# Altium project REFLOW_Controller.PrjPcb (part 3 of 3)

## Sheet FetDrv.SchDoc
size A4; SheetNumber: 5; SheetTotal: 5
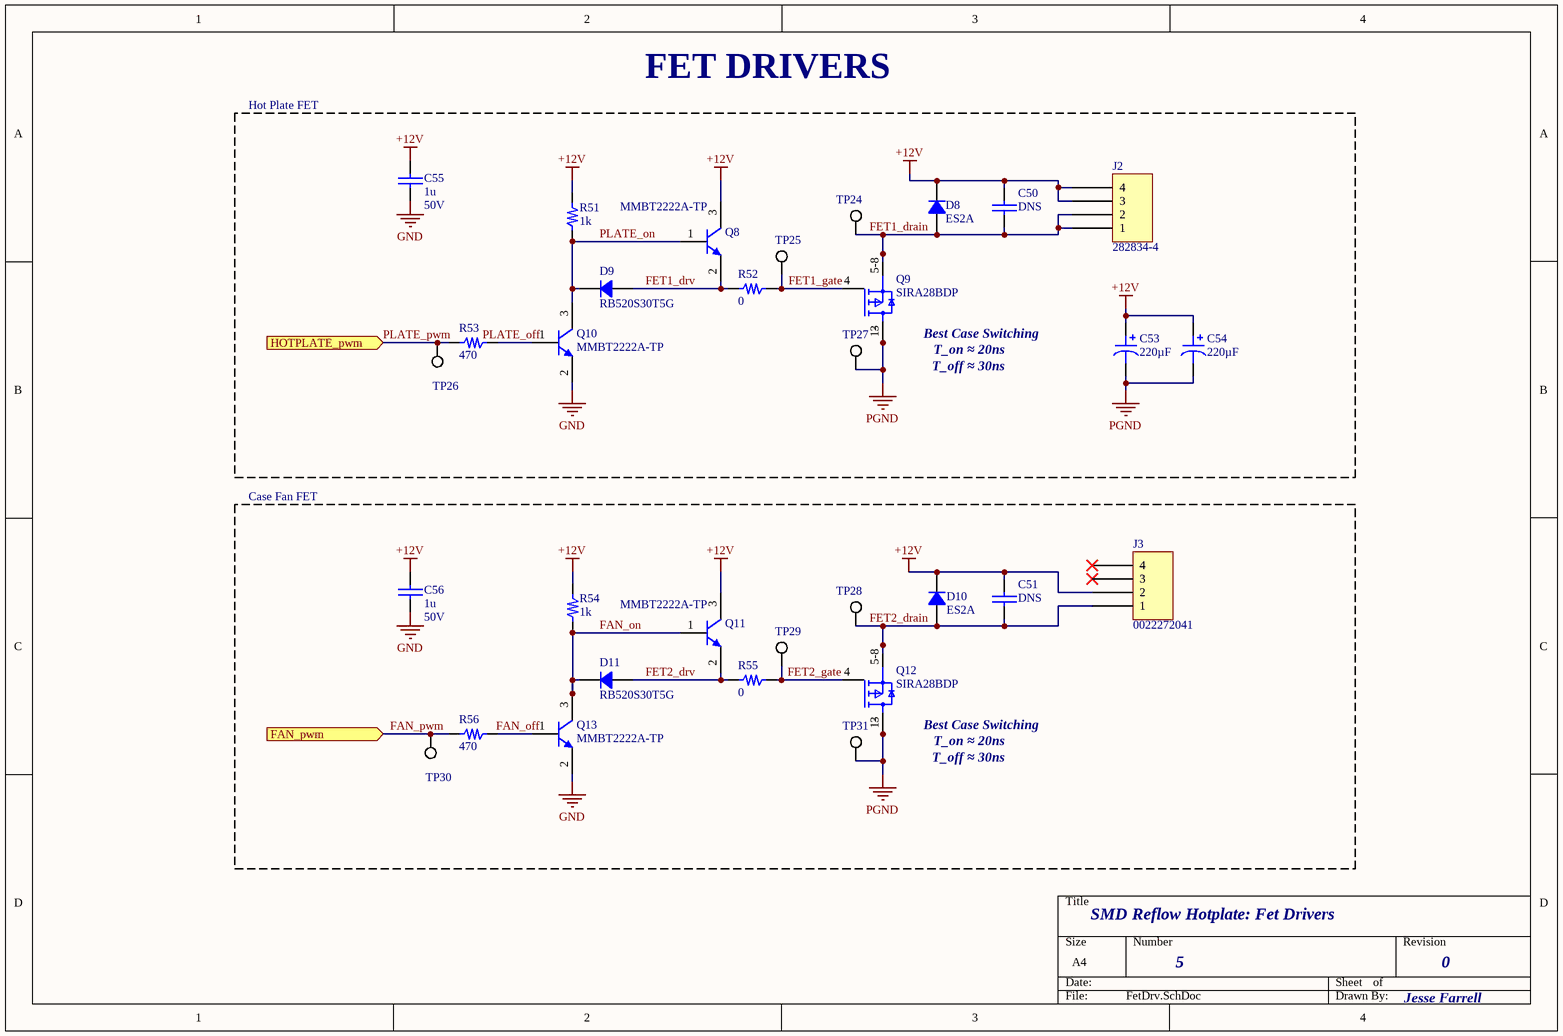
[diagram p4: FetDrv.SchDoc]

### Parts
C50  DNS  [FP-CL21-IPC_C]
C51  DNS  [FP-CL21-IPC_C]
C53  220µF  [CAP TH ALUM ELEC D8.00mm S3.50mm H13.00mm]
C54  220µF  [CAP TH ALUM ELEC D8.00mm S3.50mm H13.00mm]
C55  1u  Voltage Rating: 50V  [FP-CL10-IPC_C]
C56  1u  Voltage Rating: 50V  [FP-CL10-IPC_C]
D8  ES2A  [FP-SMA-MFG]
D9  RB520S30T5G  [SOD-523]
D10  ES2A  [FP-SMA-MFG]
D11  RB520S30T5G  [SOD-523]
J2  282834-4  [TE 282834-4]
J3  0022272041  [MOLEX KK 0022272041]
Q8  MMBT2222A-TP  [MCCSEMI SOT-23-3]
Q9  SIRA28BDP  [FP-S17-0173-SINGLE-MFG]
Q10  MMBT2222A-TP  [MCCSEMI SOT-23-3]
Q11  MMBT2222A-TP  [MCCSEMI SOT-23-3]
Q12  SIRA28BDP  [FP-S17-0173-SINGLE-MFG]
Q13  MMBT2222A-TP  [MCCSEMI SOT-23-3]
R51  1k  [FP-RMCF0603-MFG]
R52  0  [FP-RMCF0603-MFG]
R53  470  [FP-RMCF0603-MFG]
R54  1k  [FP-RMCF0603-MFG]
R55  0  [FP-RMCF0603-MFG]
R56  470  [FP-RMCF0603-MFG]
TP24  TEST POINT  [KSTN-5003]  (value not drawn)
TP25  TEST POINT  [KSTN-5003]  (value not drawn)
TP26  TEST POINT  [KSTN-5003]  (value not drawn)
TP27  BLCK TEST POINT  [FP-5001-MFG]  (value not drawn)
TP28  TEST POINT  [KSTN-5003]  (value not drawn)
TP29  TEST POINT  [KSTN-5003]  (value not drawn)
TP30  TEST POINT  [KSTN-5003]  (value not drawn)
TP31  BLCK TEST POINT  [FP-5001-MFG]  (value not drawn)

### Ports
FAN_pwm (in), HOTPLATE_pwm (in)

### Nets
+12V: C50.1 C51.1 C53.1 C54.1 C55.2 C56.2 D8.1 D10.1 J2.3 J2.4 J3.2 Q8.3(C) Q11.3(C) R51.2 R54.2
GND: C53.2 C54.2 C55.1 C56.1 Q9.1(S) Q9.2(S) Q9.3(S) Q10.2(E) Q12.1(S) Q12.2(S) Q12.3(S) Q13.2(E) TP27.1 TP31.1  [also labelled PGND]
FAN_off: Q13.1(B) R56.1
FAN_on: D11.2 Q11.1(B) Q13.3(C) R54.1
FAN_pwm: R56.2 TP30.1 ; port FAN_pwm
FET1_drain: C50.2 D8.2 J2.1 J2.2 Q9.5-8(D) TP24.1
FET1_drv: D9.1 Q8.2(E) R52.2
FET1_gate: Q9.4(G) R52.1 TP25.1
FET2_drain: C51.2 D10.2 J3.1 Q12.5-8(D) TP28.1
FET2_drv: D11.1 Q11.2(E) R55.2
FET2_gate: Q12.4(G) R55.1 TP29.1
PLATE_off: Q10.1(B) R53.1
PLATE_on: D9.2 Q8.1(B) Q10.3(C) R51.1
PLATE_pwm: R53.2 TP26.1 ; port HOTPLATE_pwm

Not connected (* = marked no-connect by the designer): J3 3* 4*

### Notes on the sheet
- Hot Plate FET
- FET DRIVERS
- (near Q9) Best Case Switching
- T_off ≈ 30ns
- T_on ≈ 20ns
- Case Fan FET
- (near Q12) Best Case Switching
- SMD Reflow Hotplate: Fet Drivers
- 5
- 0
- Jesse Farrell
- (in symbol SIRA28BDP-T1-GE3) 1-

### Library data of the parts
C50 C51 = CapTemplate0805: Capacitance: 47uF; Voltage Rating: 25V; Tolerance: 20%; Supplier 1: Digi-Key; RoHS: Yes; Category: Ceramic Capacitors; Mount: Surface Mount; Case Code (Imperial): 0805
C53 C54 = 860040474004: CAP 220 UF 20% 25 V; manufacturer: Würth Elektronik; Impedance: 150 mOhms; Lifetime @ Temp.: 7000 Hrs @ 105°C; Polarization: Polar; Ripple Current @ High Frequency: 590mA @ 100kHz; Ripple Current @ Low Frequency: 442.5mA @ 120Hz; Voltage - Rated: 25V; Part Number: 860040474004; Applications: General Purpose; Capacitance: 220µF; componentlink1description: Datasheet; componentlink1url: https://katalog.we-online.de/pbs/datasheet/860040474004.pdf; componentlink2description: DigiKey Link; componentlink2url: http://digikey.com/product-detail/en/w-rth-elektronik/860040474004/732-9171-1-ND/5729114; Device Package: Radial, Can; Height - Seated (Max): 0.512" (13.00mm); lastupdated: 2020-09-07 5:24:52 AM; Lead Spacing: 0.138" (3.50mm); Lifecycle Status: Active; Minimum Order: 1; Mounting Type: Through Hole; Operating Temperature: -40°C ~ 105°C; Package / Case: Radial, Can; packaging: TapeAndBox; partid: 23788; Part Status: Active; price: 0.19; series: WCAP-ATUL; Size / Dimension: 0.315" Dia (8.00mm); Supplier 1: DigiKey; Supplier Part Number 1: 732-9171-1-ND; Tolerance: ±20%; value: 220µF
C55 C56 = CapTemplate0603: Cap Ceramic 1uF 50V X5R 10% SMD 0603; Supplier 1: Digi-Key; RoHS: Yes; Category: Ceramic Capacitors; Mount: Surface Mount; Case/Package: 0603; Case Code (Metric): 1608; Case Code (Imperial): 0603; Packaging: Tape and Reel; Capacitance: 1uF; Tolerance: 10%; Length: 0.063inch; Width: 0.031inch; Thickness: 0.035inch
D8 D10 = ES2A: ES2A Series 2 A 50 V 20 ns Surface Mount Fast Recovery Rectifier - DO-214AA; Manufacturer: ON Semiconductor / Fairchild; Reverse Recovery Time: 20ns; Forward Current: 2A; Element Configuration: Single; Forward Voltage: 900mV; Max Reverse Current: 10uA; Max Repetitive Reverse Voltage (Vrrm): 50V; Polarity: Standard; Max Surge Current: 50A; Capacitance: 18pF; Power Dissipation: 1.66W; Supplier 1: Digi-Key; Manufacturer Part Number: ES2A; RoHS: Yes; Category: Rectifier Diodes; Stock 1: 14425; Mount: Surface Mount; Case/Package: SMB; Number of Pins: 2; Weight: 0.18g; Min Operating Temperature: -55°C; Max Operating Temperature: 150°C; Package Quantity: 1; Packaging: Tape and Reel; Voltage Rating (DC): 50V; Current Rating: 2A; Output Current: 2A; Recovery Time: 20ns; Average Rectified Current: 2A; Peak Non-Repetitive Surge Current: 50A; Max Reverse Voltage (DC): 50V; Max Forward Surge Current (Ifsm): 50A; Reverse Voltage: 50V; Radiation Hardening: No; RoHS Compliant: Yes; Lead Free: Lead Free; REACH SVHC: No SVHC; ComponentLink1URL: https://datasheet.ciiva.com/4452/es2a-187542-4452885.pdf?src-supplier=Mouser; ComponentLink1Description: https://datasheet.ciiva.com/4452/es2a-187542-4452885.pdf?src-supplier=Mouser; ComponentLink2URL: https://datasheet.ciiva.com/7965/1845305-7965133.pdf?src-supplier=Element14; ComponentLink2Description: https://datasheet.ciiva.com/7965/1845305-7965133.pdf?src-supplier=Element14; ComponentLink3URL: https://datasheet.ciiva.com/46429/1845305-46429212.pdf?src-supplier=Element14; ComponentLink3Description: https://datasheet.ciiva.com/46429/1845305-46429212.pdf?src-supplier=Element14; ComponentLink4URL: https://datasheet.ciiva.com/8300/es2d-8300846.pdf?src-supplier=Avnet; ComponentLink4Description: https://datasheet.ciiva.com/8300/es2d-8300846.pdf?src-supplier=Avnet; ComponentLink5URL: https://datasheet.ciiva.com/17271/es2a-17271335.pdf?src-supplier=Future+Electronics; ComponentLink5Description: https://datasheet.ciiva.com/17271/es2a-17271335.pdf?src-supplier=Future+Electronics; ComponentLink6URL: https://datasheet.ciiva.com/919/es2a-919275.pdf?src-supplier=Digi-Key; ComponentLink6Description: https://datasheet.ciiva.com/919/es2a-919275.pdf?src-supplier=Digi-Key; ComponentLink7URL: https://datasheet.ciiva.com/919/es2a-919276.pdf?src-supplier=Digi-Key; ComponentLink7Description: https://datasheet.ciiva.com/919/es2a-919276.pdf?src-supplier=Digi-Key; Supplier Part Number 1: ES2AFSCT-ND
D9 D11 = RB520S30T5G: DIODE SCHOTTKY 30V 200MA SOD523; Manufacturer: ON Semiconductor; Current - Average Rectified (Io): 200mA (DC); Current - Reverse Leakage @ Vr: 1µA @ 10V; Speed: Small Signal =< 200mA (Io), Any Speed; Voltage - Forward (Vf) (Max) @ If: 600mV @ 200mA; Part Number: RB520S30T5G; ComponentLink1Description: Datasheet; ComponentLink1URL: https://www.onsemi.com/pub/Collateral/RB520S30T1-D.PDF; ComponentLink2Description: DigiKey Link; ComponentLink2URL: http://digikey.com/product-detail/en/on-semiconductor/RB520S30T5G/RB520S30T5GOSCT-ND/5213385; Diode Type: Schottky; LastUpdated: 2022-05-23 1:41:49 PM; Lifecycle Status: Active; Minimum Order: 1; Mounting Type: Surface Mount; Operating Temperature - Junction: -55°C ~ 150°C; Package / Case: SC-79, SOD-523; Packaging: TapeAndReel; PartId: 2811; Part Status: Active; Price: 0.02; Series: -; Supplier 1: DigiKey; Supplier Part Number 1: RB520S30T5GOSCT-ND; Supplier Device Package: SOD-523; Voltage - DC Reverse (Vr) (Max): 30V
J2 = 282834-4: TERM BLK 4P SIDE ENT 2.54MM PCB; Manufacturer: TE Connectivity AMP Connectors; Current: 10A; Mating Orientation: Horizontal with Board; Number of Levels: 1; Pitch: 0.100" (2.54mm); Positions Per Level: 4; Voltage: 150V; Wire Gauge: 16-30 AWG; Wire Termination: Screw - Rising Cage Clamp; Part Number: 282834-4; Color: Green; ComponentLink1Description: Datasheet; ComponentLink1URL: https://www.te.com/commerce/DocumentDelivery/DDEController?Action=srchrtrv&DocNm=282834&DocType=Customer+Drawing&DocLang=English; ComponentLink2Description: DigiKey Link; ComponentLink2URL: http://digikey.com/product-detail/en/te-connectivity-amp-connectors/282834-4/A98335-ND/1153265; LastUpdated: 2020-01-15 4:16:05 AM; Lifecycle Status: Active; Minimum Order: 1; Mounting Type: Through Hole; Packaging: Bulk; Part Status: Active; Price: 2.68; Series: Buchanan; Supplier 1: DigiKey; Supplier Part Number 1: A98335-ND
J3 = 0022272041: CONN HEADER VERT 4POS 2.54MM; Manufacturer: Molex; Contact Length - Mating: 0.295" (7.49mm); Contact Length - Post: 0.140" (3.56mm); Material Flammability Rating: UL94 V-0; Number of Positions: 4; Number of Positions Loaded: All; Overall Contact Length: 0.560" (14.22mm); Pitch - Mating: 0.100" (2.54mm); Shrouding: Shrouded - 1 Wall; Style: Board to Cable/Wire; Part Number: 0022272041; ComponentLink1Description: Datasheet; ComponentLink1URL: https://www.molex.com/pdm_docs/sd/022272041_sd.pdf; ComponentLink2Description: DigiKey Link; ComponentLink2URL: http://digikey.com/product-detail/en/molex/0022272041/WM4113-ND/1130579; Connector Type: Header; Contact Finish - Mating: Tin; Contact Finish - Post: Tin; Contact Finish Thickness - Mating: 100.0µin (2.54µm); Contact Material: Brass; Contact Shape: Square; Contact Type: Male Pin; Fastening Type: Friction Lock; Insulation Color: Natural; Insulation Height: 0.461" (11.70mm); Insulation Material: Polyamide (PA), Nylon; LastUpdated: 2020-01-12 11:52:05 PM; Lifecycle Status: Active; Minimum Order: 1; Mounting Type: Through Hole; Number of Rows: 1; Packaging: Bulk; PartId: 78; Part Status: Active; Price: 0.40; Series: KK 6410; Supplier 1: DigiKey; Supplier Part Number 1: WM4113-ND; Termination: Solder
Q8 Q10 Q11 Q13 = MMBT2222A-TP: TRANS NPN 40V 0.6A SOT23; Manufacturer: Micro Commercial Co; Current - Collector (Ic) (Max): 600 mA; DC Current Gain (hFE) (Min) @ Ic, Vce: 100 @ 150mA, 10V; Frequency - Transition: 300MHz; Power - Max: 350 mW; Vce Saturation (Max) @ Ib, Ic: 1V @ 50mA, 500mA; Part Number: MMBT2222A-TP; ComponentLink1Description: Datasheet; ComponentLink1URL: https://www.mccsemi.com/pdf/Products/MMBT2222A(SOT-23).pdf; ComponentLink2Description: DigiKey Link; ComponentLink2URL: https://www.digikey.com/en/products/detail/micro-commercial-co/MMBT2222A-TP/717279; LastUpdated: 2022-06-12 6:00:23 PM; Lifecycle Status: Active; Minimum Order: 1; Mounting Type: Surface Mount; Operating Temperature: -55°C ~ 150°C (TJ); Package / Case: TO-236-3, SC-59, SOT-23-3; Packaging: TapeAndReel; PartId: 259; Part Status: Active; Price: 0.02; Series: -; Supplier 1: DigiKey; Supplier Part Number 1: MMBT2222ATPMSCT-ND; Supplier Device Package: SOT-23; Transistor Type: NPN; Voltage - Collector Emitter Breakdown (Max): 40 V
Q9 Q12 = SIRA28BDP-T1-GE3: Trans MOSFET N-CH 30V 18A 8-Pin PowerPAK SO EP T/R; Manufacturer: Vishay; Supplier 1: Digi-Key; Manufacturer Part Number: SIRA28BDP-T1-GE3; RoHS: Yes; Stock 1: 1312; Supplier Part Number 1: SIRA28BDP-T1-GE3CT-ND
R51 R54 = ResTemplate0603: Res 0603 1K Ohm 1% 1/10W; Tolerance: ???%; Power Rating: ???mW; Resistance: ???; Supplier 1: Digi-Key; Category: Chip SMD Resistors; Mount: Surface Mount; Case/Package: 0603; Case Code (Metric): 1608; Case Code (Imperial): 0603; Number of Terminations: 2; Length: 0.061inch; Width: 0.031inch; Height: 0.022inch
R52 R55 = ResTemplate0603: Res 0603 0 Ohm 1% 1/10W; Tolerance: ???%; Power Rating: ???mW; Resistance: ???; Supplier 1: Digi-Key; Category: Chip SMD Resistors; Mount: Surface Mount; Case/Package: 0603; Case Code (Metric): 1608; Case Code (Imperial): 0603; Number of Terminations: 2; Length: 0.061inch; Width: 0.031inch; Height: 0.022inch
R53 R56 = ResTemplate0603: Res 0603 100 Ohm 1% 1/10W; Tolerance: ???%; Power Rating: ???mW; Resistance: ???; Supplier 1: Digi-Key; Category: Chip SMD Resistors; Mount: Surface Mount; Case/Package: 0603; Case Code (Metric): 1608; Case Code (Imperial): 0603; Number of Terminations: 2; Length: 0.061inch; Width: 0.031inch; Height: 0.022inch
TP24-TP26 TP28-TP30 = 5003: Test Point;  Miniature;  THM;  H .300;  Nylon 46 Insulated Orange;  PhosBronze/Silver; Manufacturer: Keystone Electronics; Body Material: PBT; Plating: Silver; Inside Diameter: 1.27mm; Outside Diameter: 2.54mm; Supplier 1: Digi-Key; Manufacturer Part Number: 5003; RoHS: Yes; Category: Connectors; Stock 1: 166018; Mount: PCB,Through Hole; Number of Pins: 1; Contact Material: Bronze; Contact Plating: Silver,Tin; Material: Nylon,Bronze,Silver; Color: Orange,White; Package Quantity: 10; Packaging: Bulk; Series: THM; Termination: Through Hole; Length: 7.62mm; Height: 0.3inch; REACH SVHC: No SVHC; Lead Free: Lead Free; RoHS Compliant: Yes; Flammability Rating: UL94 V-0; ComponentLink1URL: https://datasheet.ciiva.com/16885/70182825-16885788.pdf?src-supplier=Allied+Electronics; ComponentLink1Description: https://datasheet.ciiva.com/16885/70182825-16885788.pdf?src-supplier=Allied+Electronics; ComponentLink2URL: https://datasheet.ciiva.com/1454/1703983-1454826.pdf?src-supplier=Element14; ComponentLink2Description: https://datasheet.ciiva.com/1454/1703983-1454826.pdf?src-supplier=Element14; ComponentLink3URL: https://datasheet.ciiva.com/22631/1703983-22631103.pdf?src-supplier=Element14; ComponentLink3Description: https://datasheet.ciiva.com/22631/1703983-22631103.pdf?src-supplier=Element14; ComponentLink4URL: https://datasheet.ciiva.com/4598/5000-5004-4598618.pdf?src-supplier=Mouser; ComponentLink4Description: https://datasheet.ciiva.com/4598/5000-5004-4598618.pdf?src-supplier=Mouser; Supplier Part Number 1: 36-5003-ND
TP27 TP31 = 5001: TEST POINT PC MINI .040D BLACK; Manufacturer: Keystone Electronics; Body Material: Bronze; Plating: Silver; Number of Ports: 1; Insulation: Insulated; Inside Diameter: 1.27mm; Outside Diameter: 2.54mm; Hole Diameter: 1.6mm; Supplier 1: Digi-Key; Manufacturer Part Number: 5001; RoHS: Yes; Category: Test Probes, Leads and Clips; Stock 1: 1368499; Mount: Through Hole; Contact Material: Bronze; Contact Plating: Silver,Tin; Material: Nylon,Bronze,Silver; Color: Black; Insulation Material: Nylon; Housing Color: Black; Package Quantity: 100; Packaging: Bulk; Series: THM; Termination: Through Hole; Orientation: Straight; Number of Contacts: 1; Diameter: 2.54mm; Length: 7.62mm; Height: 0.3inch; REACH SVHC: No SVHC; Lead Free: Lead Free; RoHS Compliant: Yes; Flammability Rating: UL94 V-0; ComponentLink1URL: https://datasheet.ciiva.com/11836/0900766b8009b7c7-11836045.pdf?src-supplier=RSComponents; ComponentLink1Description: https://datasheet.ciiva.com/11836/0900766b8009b7c7-11836045.pdf?src-supplier=RSComponents; ComponentLink2URL: https://datasheet.ciiva.com/27052/1581986-27052611.pdf?src-supplier=Jameco; ComponentLink2Description: https://datasheet.ciiva.com/27052/1581986-27052611.pdf?src-supplier=Jameco; ComponentLink3URL: https://datasheet.ciiva.com/16318/m60-2p60-16318423.pdf?src-supplier=Future+Electronics; ComponentLink3Description: https://datasheet.ciiva.com/16318/m60-2p60-16318423.pdf?src-supplier=Future+Electronics; ComponentLink4URL: https://datasheet.ciiva.com/22631/1703983-22631100.pdf?src-supplier=Element14; ComponentLink4Description: https://datasheet.ciiva.com/22631/1703983-22631100.pdf?src-supplier=Element14; Supplier Part Number 1: 36-5001-ND

## Nets that join several sheets
+3V3: Power (10 pins), MCU (20 pins), Sensors (9 pins)
+12V: Power (11 pins), FetDrv (15 pins)
GND: Power (56 pins), MCU (32 pins), Sensors (24 pins), FetDrv (14 pins)
3V3_PG: Power (R3.2 TP6.1 U1.8), MCU (U3.50)
12V_EN_in: Power (R12.2), MCU (U3.2)
BUZZER: MCU (U3.53), Sensors (R48.2 TP19.1)
DEB_A: MCU (U3.35), Sensors (C46.2 R44.2)
DEB_B: MCU (U3.34), Sensors (C47.2 R45.2)
DISP_DBL: MCU (U3.25), Sensors (R50.2)
FAN_pwm: MCU (U3.16), FetDrv (R56.2 TP30.1)
I2C1_SCL: MCU (JP5.2 R26.1 U3.58), Sensors (U4.1 U5.2 U6.1)
I2C1_SDA: MCU (JP5.1 R25.1 U3.59), Sensors (U4.4 U5.1 U6.2)
IMU_INT1: MCU (U3.27), Sensors (U4.12)
IMU_INT2: MCU (U3.28), Sensors (U4.11)
LCD_BL: MCU (U3.9), Sensors (P2.8)
LCD_CLK: MCU (U3.21), Sensors (P2.4)
LCD_CS: MCU (U3.17), Sensors (P2.5)
LCD_DC: MCU (U3.20), Sensors (P2.6)
LCD_DIN: MCU (U3.23), Sensors (P2.3)
LCD_RST: MCU (U3.22), Sensors (P2.7)
PLATE_pwm: MCU (U3.41), FetDrv (R53.2 TP26.1)
ROT_SW: MCU (U3.36), Sensors (C44.2 P1.1 R40.2)
SNS_DBL: MCU (U3.24), Sensors (R49.2)
SYNC_in: Power (R7.2 TP7.1), MCU (U3.14)
TEMP_INT: MCU (U3.26), Sensors (R38.2 U5.3)